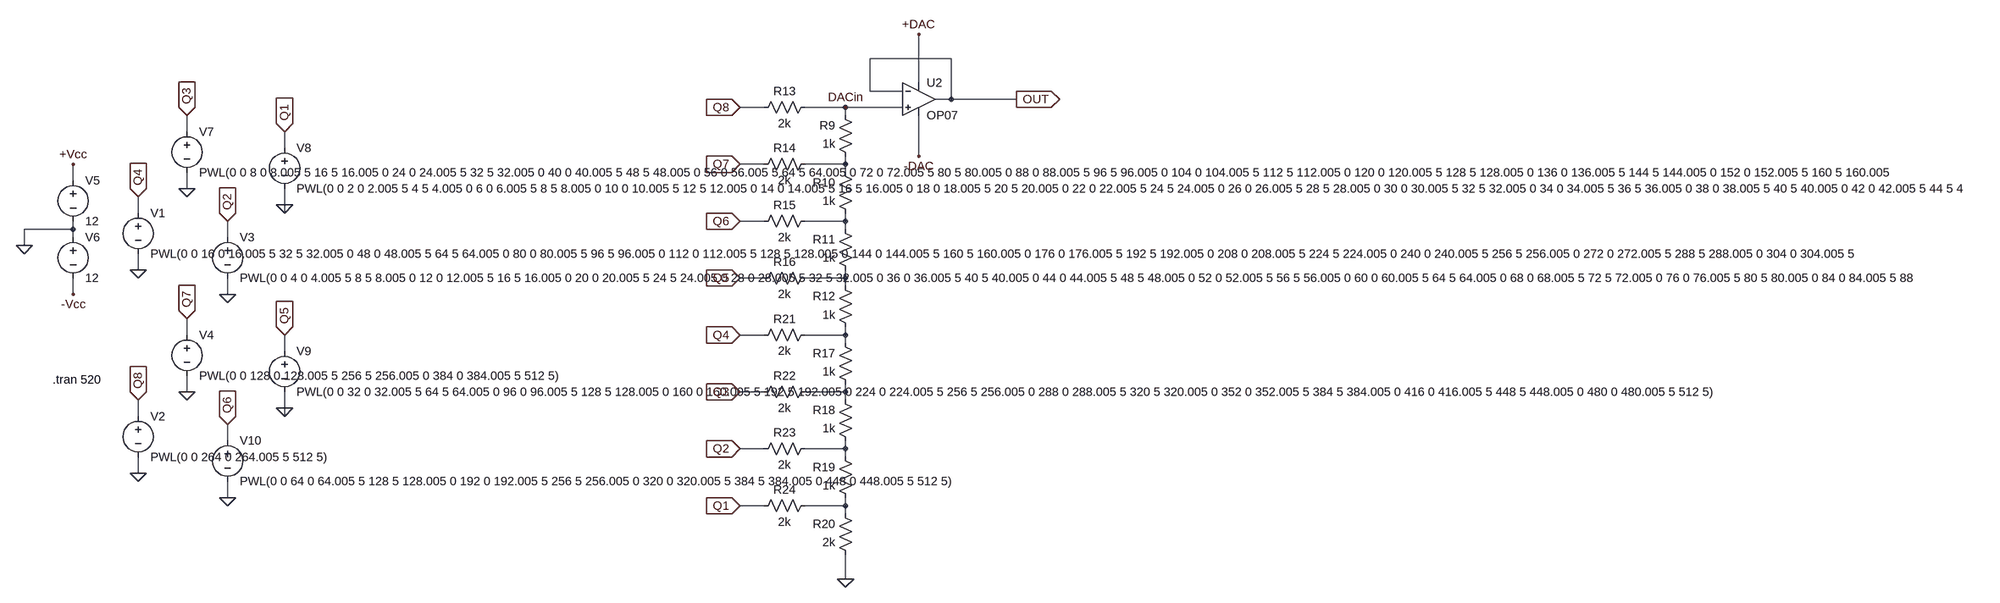
[diagram p0: schematic Ldder_DAC.asc]
Ldder_DAC.asc, the LTspice schematic file:
Version 4
SHEET 1 48964 1184
WIRE 1312 144 1152 144
WIRE 1248 192 1248 96
WIRE 1152 208 1152 144
WIRE 1216 208 1152 208
WIRE 1312 224 1312 144
WIRE 1312 224 1280 224
WIRE 1440 224 1312 224
WIRE 944 240 896 240
WIRE 1104 240 1024 240
WIRE 1216 240 1104 240
WIRE 1104 256 1104 240
WIRE -192 288 -192 256
WIRE 0 320 0 288
WIRE 1248 336 1248 256
WIRE 944 352 896 352
WIRE 1104 352 1104 336
WIRE 1104 352 1024 352
WIRE 1104 368 1104 352
WIRE -416 384 -416 352
WIRE -192 400 -192 368
WIRE 0 432 0 400
WIRE -288 448 -288 416
WIRE 0 448 0 432
WIRE 944 464 896 464
WIRE 1104 464 1104 448
WIRE 1104 464 1024 464
WIRE -416 480 -416 464
WIRE -416 480 -512 480
WIRE 1104 480 1104 464
WIRE -416 496 -416 480
WIRE -112 496 -112 464
WIRE -512 512 -512 480
WIRE -288 560 -288 528
WIRE 944 576 896 576
WIRE 1104 576 1104 560
WIRE 1104 576 1024 576
WIRE 1104 592 1104 576
WIRE -416 608 -416 576
WIRE -112 608 -112 576
WIRE -192 688 -192 656
WIRE 944 688 896 688
WIRE 1104 688 1104 672
WIRE 1104 688 1024 688
WIRE 1104 704 1104 688
WIRE 0 720 0 688
WIRE -192 800 -192 768
WIRE 944 800 896 800
WIRE 1104 800 1104 784
WIRE 1104 800 1024 800
WIRE 1104 816 1104 800
WIRE 0 832 0 800
WIRE -288 848 -288 816
WIRE 0 848 0 832
WIRE -112 896 -112 864
WIRE 944 912 896 912
WIRE 1104 912 1104 896
WIRE 1104 912 1024 912
WIRE 1104 928 1104 912
WIRE -288 960 -288 928
WIRE -112 1008 -112 976
WIRE 944 1024 896 1024
WIRE 1104 1024 1104 1008
WIRE 1104 1024 1024 1024
WIRE 1104 1040 1104 1024
WIRE 1104 1168 1104 1120
FLAG -288 560 0
FLAG -288 416 Q4
IOPIN -288 416 In
FLAG 1440 224 OUT
IOPIN 1440 224 Out
FLAG 896 240 Q8
IOPIN 896 240 In
FLAG 896 352 Q7
IOPIN 896 352 In
FLAG 896 464 Q6
IOPIN 896 464 In
FLAG 896 576 Q5
IOPIN 896 576 In
FLAG 1248 96 +DAC
FLAG 1248 336 -DAC
FLAG 896 688 Q4
IOPIN 896 688 In
FLAG 896 800 Q3
IOPIN 896 800 In
FLAG 896 912 Q2
IOPIN 896 912 In
FLAG 896 1024 Q1
IOPIN 896 1024 In
FLAG 1104 1168 0
FLAG 1104 240 DACin
FLAG -192 400 0
FLAG -192 256 Q3
IOPIN -192 256 In
FLAG 0 432 0
FLAG 0 288 Q1
IOPIN 0 288 In
FLAG -112 608 0
FLAG -112 464 Q2
IOPIN -112 464 In
FLAG -288 960 0
FLAG -288 816 Q8
IOPIN -288 816 In
FLAG -192 800 0
FLAG -192 656 Q7
IOPIN -192 656 In
FLAG 0 832 0
FLAG 0 688 Q5
IOPIN 0 688 In
FLAG -112 1008 0
FLAG -112 864 Q6
IOPIN -112 864 In
FLAG -416 352 +Vcc
FLAG -512 512 0
FLAG -416 608 -Vcc
SYMBOL voltage -288 432 R0
SYMATTR InstName V1
SYMATTR Value PWL(0 0 16 0 16.005 5 32 5 32.005 0 48 0 48.005 5 64 5 64.005 0 80 0 80.005 5 96 5 96.005 0 112 0 112.005 5 128 5 128.005 0 144 0 144.005 5 160 5 160.005 0 176 0 176.005 5 192 5 192.005 0 208 0 208.005 5 224 5 224.005 0 240 0 240.005 5 256 5 256.005 0 272 0 272.005 5 288 5 288.005 0 304 0 304.005 5 320 5 320.005 0 336 0 336.005 5 352 5 352.005 0 368 0 368.005 5 384 5 384.005 0 400 0 400.005 5 416 5 416.005 0 432 0 432.005 5 448 5 448.005 0 464 0 464.005 5 480 5 480.005 0 496 0 496.005 5 512 5)
SYMBOL OpAmps/OP07 1248 160 R0
SYMATTR InstName U2
SYMBOL Res 1120 352 R180
WINDOW 0 36 76 Left 2
WINDOW 3 36 40 Left 2
SYMATTR InstName R9
SYMATTR Value 1k
SYMBOL Res 1120 464 R180
WINDOW 0 36 76 Left 2
WINDOW 3 36 40 Left 2
SYMATTR InstName R10
SYMATTR Value 1k
SYMBOL Res 1120 576 R180
WINDOW 0 36 76 Left 2
WINDOW 3 36 40 Left 2
SYMATTR InstName R11
SYMATTR Value 1k
SYMBOL Res 1120 688 R180
WINDOW 0 36 76 Left 2
WINDOW 3 36 40 Left 2
SYMATTR InstName R12
SYMATTR Value 1k
SYMBOL Res 1040 224 R90
WINDOW 0 0 56 VBottom 2
WINDOW 3 32 56 VTop 2
SYMATTR InstName R13
SYMATTR Value 2k
SYMBOL Res 1040 336 R90
WINDOW 0 0 56 VBottom 2
WINDOW 3 32 56 VTop 2
SYMATTR InstName R14
SYMATTR Value 2k
SYMBOL Res 1040 448 R90
WINDOW 0 0 56 VBottom 2
WINDOW 3 32 56 VTop 2
SYMATTR InstName R15
SYMATTR Value 2k
SYMBOL Res 1040 560 R90
WINDOW 0 0 56 VBottom 2
WINDOW 3 32 56 VTop 2
SYMATTR InstName R16
SYMATTR Value 2k
SYMBOL Res 1120 800 R180
WINDOW 0 36 76 Left 2
WINDOW 3 36 40 Left 2
SYMATTR InstName R17
SYMATTR Value 1k
SYMBOL Res 1120 912 R180
WINDOW 0 36 76 Left 2
WINDOW 3 36 40 Left 2
SYMATTR InstName R18
SYMATTR Value 1k
SYMBOL Res 1120 1024 R180
WINDOW 0 36 76 Left 2
WINDOW 3 36 40 Left 2
SYMATTR InstName R19
SYMATTR Value 1k
SYMBOL Res 1120 1136 R180
WINDOW 0 36 76 Left 2
WINDOW 3 36 40 Left 2
SYMATTR InstName R20
SYMATTR Value 2k
SYMBOL Res 1040 672 R90
WINDOW 0 0 56 VBottom 2
WINDOW 3 32 56 VTop 2
SYMATTR InstName R21
SYMATTR Value 2k
SYMBOL Res 1040 784 R90
WINDOW 0 0 56 VBottom 2
WINDOW 3 32 56 VTop 2
SYMATTR InstName R22
SYMATTR Value 2k
SYMBOL Res 1040 896 R90
WINDOW 0 0 56 VBottom 2
WINDOW 3 32 56 VTop 2
SYMATTR InstName R23
SYMATTR Value 2k
SYMBOL Res 1040 1008 R90
WINDOW 0 0 56 VBottom 2
WINDOW 3 32 56 VTop 2
SYMATTR InstName R24
SYMATTR Value 2k
SYMBOL voltage -192 272 R0
SYMATTR InstName V7
SYMATTR Value PWL(0 0 8 0 8.005 5 16 5 16.005 0 24 0 24.005 5 32 5 32.005 0 40 0 40.005 5 48 5 48.005 0 56 0 56.005 5 64 5 64.005 0 72 0 72.005 5 80 5 80.005 0 88 0 88.005 5 96 5 96.005 0 104 0 104.005 5 112 5 112.005 0 120 0 120.005 5 128 5 128.005 0 136 0 136.005 5 144 5 144.005 0 152 0 152.005 5 160 5 160.005 0 168 0 168.005 5 176 5 176.005 0 184 0 184.005 5 192 5 192.005 0 200 0 200.005 5 208 5 208.005 0 216 0 216.005 5 224 5 224.005 0 232 0 232.005 5 240 5 240.005 0 248 0 248.005 5 256 5 256.005 0 264 0 264.005 5 272 5 272.005 0 280 0 280.005 5 288 5 288.005 0 296 0 296.005 5 304 5 304.005 0 312 0 312.005 5 320 5 320.005 0 328 0 328.005 5 336 5 336.005 0 344 0 344.005 5 352 5 352.005 0 360 0 360.005 5 368 5 368.005 0 376 0 376.005 5 384 5 384.005 0 392 0 392.005 5 400 5 400.005 0 408 0 408.005 5 416 5 416.005 0 424 0 424.005 5 432 5 432.005 0 440 0 440.005 5 448 5 448.005 0 456 0 456.005 5 464 5 464.005 0 472 0 472.005 5 480 5 480.005 0 488 0 488.005 5 496 5 496.005 0 504 0 504.005 5 512 5)
SYMBOL voltage 0 304 R0
SYMATTR InstName V8
SYMATTR Value PWL(0 0 2 0 2.005 5 4 5 4.005 0 6 0 6.005 5 8 5 8.005 0 10 0 10.005 5 12 5 12.005 0 14 0 14.005 5 16 5 16.005 0 18 0 18.005 5 20 5 20.005 0 22 0 22.005 5 24 5 24.005 0 26 0 26.005 5 28 5 28.005 0 30 0 30.005 5 32 5 32.005 0 34 0 34.005 5 36 5 36.005 0 38 0 38.005 5 40 5 40.005 0 42 0 42.005 5 44 5 44.005 0 46 0 46.005 5 48 5 48.005 0 50 0 50.005 5 52 5 52.005 0 54 0 54.005 5 56 5 56.005 0 58 0 58.005 5 60 5 60.005 0 62 0 62.005 5 64 5 64.005 0 66 0 66.005 5 68 5 68.005 0 70 0 70.005 5 72 5 72.005 0 74 0 74.005 5 76 5 76.005 0 78 0 78.005 5 80 5 80.005 0 82 0 82.005 5 84 5 84.005 0 86 0 86.005 5 88 5 88.005 0 90 0 90.005 5 92 5 92.005 0 94 0 94.005 5 96 5 96.005 0 98 0 98.005 5 100 5 100.005 0 102 0 102.005 5 104 5 104.005 0 106 0 106.005 5 108 5 108.005 0 110 0 110.005 5 112 5 112.005 0 114 0 114.005 5 116 5 116.005 0 118 0 118.005 5 120 5 120.005 0 122 0 122.005 5 124 5 124.005 0 126 0 126.005 5 128 5 128.005 0 130 0 130.005 5 132 5 132.005 0 134 0 134.005 5 136 5 136.005 0 138 0 138.005 5 140 5 140.005 0 142 0 142.005 5 144 5 144.005 0 146 0 146.005 5 148 5 148.005 0 150 0 150.005 5 152 5 152.005 0 154 0 154.005 5 156 5 156.005 0 158 0 158.005 5 160 5 160.005 0 162 0 162.005 5 164 5 164.005 0 166 0 166.005 5 168 5 168.005 0 170 0 170.005 5 172 5 172.005 0 174 0 174.005 5 176 5 176.005 0 178 0 178.005 5 180 5 180.005 0 182 0 182.005 5 184 5 184.005 0 186 0 186.005 5 188 5 188.005 0 190 0 190.005 5 192 5 192.005 0 194 0 194.005 5 196 5 196.005 0 198 0 198.005 5 200 5 200.005 0 202 0 202.005 5 204 5 204.005 0 206 0 206.005 5 208 5 208.005 0 210 0 210.005 5 212 5 212.005 0 214 0 214.005 5 216 5 216.005 0 218 0 218.005 5 220 5 220.005 0 222 0 222.005 5 224 5 224.005 0 226 0 226.005 5 228 5 228.005 0 230 0 230.005 5 232 5 232.005 0 234 0 234.005 5 236 5 236.005 0 238 0 238.005 5 240 5 240.005 0 242 0 242.005 5 244 5 244.005 0 246 0 246.005 5 248 5 248.005 0 250 0 250.005 5 252 5 252.005 0 254 0 254.005 5 256 5 256.005 0 258 0 258.005 5 260 5 260.005 0 262 0 262.005 5 264 5 264.005 0 266 0 266.005 5 268 5 268.005 0 270 0 270.005 5 272 5 272.005 0 274 0 274.005 5 276 5 276.005 0 278 0 278.005 5 280 5 280.005 0 282 0 282.005 5 284 5 284.005 0 286 0 286.005 5 288 5 288.005 0 290 0 290.005 5 292 5 292.005 0 294 0 294.005 5 296 5 296.005 0 298 0 298.005 5 300 5 300.005 0 302 0 302.005 5 304 5 304.005 0 306 0 306.005 5 308 5 308.005 0 310 0 310.005 5 312 5 312.005 0 314 0 314.005 5 316 5 316.005 0 318 0 318.005 5 320 5 320.005 0 322 0 322.005 5 324 5 324.005 0 326 0 326.005 5 328 5 328.005 0 330 0 330.005 5 332 5 332.005 0 334 0 334.005 5 336 5 336.005 0 338 0 338.005 5 340 5 340.005 0 342 0 342.005 5 344 5 344.005 0 346 0 346.005 5 348 5 348.005 0 350 0 350.005 5 352 5 352.005 0 354 0 354.005 5 356 5 356.005 0 358 0 358.005 5 360 5 360.005 0 362 0 362.005 5 364 5 364.005 0 366 0 366.005 5 368 5 368.005 0 370 0 370.005 5 372 5 372.005 0 374 0 374.005 5 376 5 376.005 0 378 0 378.005 5 380 5 380.005 0 382 0 382.005 5 384 5 384.005 0 386 0 386.005 5 388 5 388.005 0 390 0 390.005 5 392 5 392.005 0 394 0 394.005 5 396 5 396.005 0 398 0 398.005 5 400 5 400.005 0 402 0 402.005 5 404 5 404.005 0 406 0 406.005 5 408 5 408.005 0 410 0 410.005 5 412 5 412.005 0 414 0 414.005 5 416 5 416.005 0 418 0 418.005 5 420 5 420.005 0 422 0 422.005 5 424 5 424.005 0 426 0 426.005 5 428 5 428.005 0 430 0 430.005 5 432 5 432.005 0 434 0 434.005 5 436 5 436.005 0 438 0 438.005 5 440 5 440.005 0 442 0 442.005 5 444 5 444.005 0 446 0 446.005 5 448 5 448.005 0 450 0 450.005 5 452 5 452.005 0 454 0 454.005 5 456 5 456.005 0 458 0 458.005 5 460 5 460.005 0 462 0 462.005 5 464 5 464.005 0 466 0 466.005 5 468 5 468.005 0 470 0 470.005 5 472 5 472.005 0 474 0 474.005 5 476 5 476.005 0 478 0 478.005 5 480 5 480.005 0 482 0 482.005 5 484 5 484.005 0 486 0 486.005 5 488 5 488.005 0 490 0 490.005 5 492 5 492.005 0 494 0 494.005 5 496 5 496.005 0 498 0 498.005 5 500 5 500.005 0 502 0 502.005 5 504 5 504.005 0 506 0 506.005 5 508 5 508.005 0 510 0 510.005 5 512 5)
SYMBOL voltage -112 480 R0
SYMATTR InstName V3
SYMATTR Value PWL(0 0 4 0 4.005 5 8 5 8.005 0 12 0 12.005 5 16 5 16.005 0 20 0 20.005 5 24 5 24.005 0 28 0 28.005 5 32 5 32.005 0 36 0 36.005 5 40 5 40.005 0 44 0 44.005 5 48 5 48.005 0 52 0 52.005 5 56 5 56.005 0 60 0 60.005 5 64 5 64.005 0 68 0 68.005 5 72 5 72.005 0 76 0 76.005 5 80 5 80.005 0 84 0 84.005 5 88 5 88.005 0 92 0 92.005 5 96 5 96.005 0 100 0 100.005 5 104 5 104.005 0 108 0 108.005 5 112 5 112.005 0 116 0 116.005 5 120 5 120.005 0 124 0 124.005 5 128 5 128.005 0 132 0 132.005 5 136 5 136.005 0 140 0 140.005 5 144 5 144.005 0 148 0 148.005 5 152 5 152.005 0 156 0 156.005 5 160 5 160.005 0 164 0 164.005 5 168 5 168.005 0 172 0 172.005 5 176 5 176.005 0 180 0 180.005 5 184 5 184.005 0 188 0 188.005 5 192 5 192.005 0 196 0 196.005 5 200 5 200.005 0 204 0 204.005 5 208 5 208.005 0 212 0 212.005 5 216 5 216.005 0 220 0 220.005 5 224 5 224.005 0 228 0 228.005 5 232 5 232.005 0 236 0 236.005 5 240 5 240.005 0 244 0 244.005 5 248 5 248.005 0 252 0 252.005 5 256 5 256.005 0 260 0 260.005 5 264 5 264.005 0 268 0 268.005 5 272 5 272.005 0 276 0 276.005 5 280 5 280.005 0 284 0 284.005 5 288 5 288.005 0 292 0 292.005 5 296 5 296.005 0 300 0 300.005 5 304 5 304.005 0 308 0 308.005 5 312 5 312.005 0 316 0 316.005 5 320 5 320.005 0 324 0 324.005 5 328 5 328.005 0 332 0 332.005 5 336 5 336.005 0 340 0 340.005 5 344 5 344.005 0 348 0 348.005 5 352 5 352.005 0 356 0 356.005 5 360 5 360.005 0 364 0 364.005 5 368 5 368.005 0 372 0 372.005 5 376 5 376.005 0 380 0 380.005 5 384 5 384.005 0 388 0 388.005 5 392 5 392.005 0 396 0 396.005 5 400 5 400.005 0 404 0 404.005 5 408 5 408.005 0 412 0 412.005 5 416 5 416.005 0 420 0 420.005 5 424 5 424.005 0 428 0 428.005 5 432 5 432.005 0 436 0 436.005 5 440 5 440.005 0 444 0 444.005 5 448 5 448.005 0 452 0 452.005 5 456 5 456.005 0 460 0 460.005 5 464 5 464.005 0 468 0 468.005 5 472 5 472.005 0 476 0 476.005 5 480 5 480.005 0 484 0 484.005 5 488 5 488.005 0 492 0 492.005 5 496 5 496.005 0 500 0 500.005 5 504 5 504.005 0 508 0 508.005 5 512 5)
SYMBOL voltage -288 832 R0
SYMATTR InstName V2
SYMATTR Value PWL(0 0 264 0 264.005 5 512 5)
SYMBOL voltage -192 672 R0
SYMATTR InstName V4
SYMATTR Value PWL(0 0 128 0 128.005 5 256 5 256.005 0 384 0 384.005 5 512 5)
SYMBOL voltage 0 704 R0
SYMATTR InstName V9
SYMATTR Value PWL(0 0 32 0 32.005 5 64 5 64.005 0 96 0 96.005 5 128 5 128.005 0 160 0 160.005 5 192 5 192.005 0 224 0 224.005 5 256 5 256.005 0 288 0 288.005 5 320 5 320.005 0 352 0 352.005 5 384 5 384.005 0 416 0 416.005 5 448 5 448.005 0 480 0 480.005 5 512 5)
SYMBOL voltage -112 880 R0
SYMATTR InstName V10
SYMATTR Value PWL(0 0 64 0 64.005 5 128 5 128.005 0 192 0 192.005 5 256 5 256.005 0 320 0 320.005 5 384 5 384.005 0 448 0 448.005 5 512 5)
SYMBOL voltage -416 368 R0
SYMATTR InstName V5
SYMATTR Value 12
SYMBOL voltage -416 480 R0
SYMATTR InstName V6
SYMATTR Value 12
TEXT -456 776 Left 2 !.tran 520

The netlist it stands for:
* Ldder_DAC.asc
V1 Q4 0 PWL(0 0 16 0 16.005 5 32 5 32.005 0 48 0 48.005 5 64 5 64.005 0 80 0 80.005 5 96 5 96.005 0 112 0 112.005 5 128 5 128.005 0 144 0 144.005 5 160 5 160.005 0 176 0 176.005 5 192 5 192.005 0 208 0 208.005 5 224 5 224.005 0 240 0 240.005 5 256 5 256.005 0 272 0 272.005 5 288 5 288.005 0 304 0 304.005 5 320 5 320.005 0 336 0 336.005 5 352 5 352.005 0 368 0 368.005 5 384 5 384.005 0 400 0 400.005 5 416 5 416.005 0 432 0 432.005 5 448 5 448.005 0 464 0 464.005 5 480 5 480.005 0 496 0 496.005 5 512 5)
XU2 DACin OUT +DAC -DAC OUT LT1001  ; OP07, pins In+ In- V+ V- OUT
R9 N001 DACin 1k
R10 N002 N001 1k
R11 N003 N002 1k
R12 N004 N003 1k
R13 DACin Q8 2k
R14 N001 Q7 2k
R15 N002 Q6 2k
R16 N003 Q5 2k
R17 N005 N004 1k
R18 N006 N005 1k
R19 N007 N006 1k
R20 0 N007 2k
R21 N004 Q4 2k
R22 N005 Q3 2k
R23 N006 Q2 2k
R24 N007 Q1 2k
V7 Q3 0 PWL(0 0 8 0 8.005 5 16 5 16.005 0 24 0 24.005 5 32 5 32.005 0 40 0 40.005 5 48 5 48.005 0 56 0 56.005 5 64 5 64.005 0 72 0 72.005 5 80 5 80.005 0 88 0 88.005 5 96 5 96.005 0 104 0 104.005 5 112 5 112.005 0 120 0 120.005 5 128 5 128.005 0 136 0 136.005 5 144 5 144.005 0 152 0 152.005 5 160 5 160.005 0 168 0 168.005 5 176 5 176.005 0 184 0 184.005 5 192 5 192.005 0 200 0 200.005 5 208 5 208.005 0 216 0 216.005 5 224 5 224.005 0 232 0 232.005 5 240 5 240.005 0 248 0 248.005 5 256 5 256.005 0 264 0 264.005 5 272 5 272.005 0 280 0 280.005 5 288 5 288.005 0 296 0 296.005 5 304 5 304.005 0 312 0 312.005 5 320 5 320.005 0 328 0 328.005 5 336 5 336.005 0 344 0 344.005 5 352 5 352.005 0 360 0 360.005 5 368 5 368.005 0 376 0 376.005 5 384 5 384.005 0 392 0 392.005 5 400 5 400.005 0 408 0 408.005 5 416 5 416.005 0 424 0 424.005 5 432 5 432.005 0 440 0 440.005 5 448 5 448.005 0 456 0 456.005 5 464 5 464.005 0 472 0 472.005 5 480 5 480.005 0 488 0 488.005 5 496 5 496.005 0 504 0 504.005 5 512 5)
V8 Q1 0 PWL(0 0 2 0 2.005 5 4 5 4.005 0 6 0 6.005 5 8 5 8.005 0 10 0 10.005 5 12 5 12.005 0 14 0 14.005 5 16 5 16.005 0 18 0 18.005 5 20 5 20.005 0 22 0 22.005 5 24 5 24.005 0 26 0 26.005 5 28 5 28.005 0 30 0 30.005 5 32 5 32.005 0 34 0 34.005 5 36 5 36.005 0 38 0 38.005 5 40 5 40.005 0 42 0 42.005 5 44 5 44.005 0 46 0 46.005 5 48 5 48.005 0 50 0 50.005 5 52 5 52.005 0 54 0 54.005 5 56 5 56.005 0 58 0 58.005 5 60 5 60.005 0 62 0 62.005 5 64 5 64.005 0 66 0 66.005 5 68 5 68.005 0 70 0 70.005 5 72 5 72.005 0 74 0 74.005 5 76 5 76.005 0 78 0 78.005 5 80 5 80.005 0 82 0 82.005 5 84 5 84.005 0 86 0 86.005 5 88 5 88.005 0 90 0 90.005 5 92 5 92.005 0 94 0 94.005 5 96 5 96.005 0 98 0 98.005 5 100 5 100.005 0 102 0 102.005 5 104 5 104.005 0 106 0 106.005 5 108 5 108.005 0 110 0 110.005 5 112 5 112.005 0 114 0 114.005 5 116 5 116.005 0 118 0 118.005 5 120 5 120.005 0 122 0 122.005 5 124 5 124.005 0 126 0 126.005 5 128 5 128.005 0 130 0 130.005 5 132 5 132.005 0 134 0 134.005 5 136 5 136.005 0 138 0 138.005 5 140 5 140.005 0 142 0 142.005 5 144 5 144.005 0 146 0 146.005 5 148 5 148.005 0 150 0 150.005 5 152 5 152.005 0 154 0 154.005 5 156 5 156.005 0 158 0 158.005 5 160 5 160.005 0 162 0 162.005 5 164 5 164.005 0 166 0 166.005 5 168 5 168.005 0 170 0 170.005 5 172 5 172.005 0 174 0 174.005 5 176 5 176.005 0 178 0 178.005 5 180 5 180.005 0 182 0 182.005 5 184 5 184.005 0 186 0 186.005 5 188 5 188.005 0 190 0 190.005 5 192 5 192.005 0 194 0 194.005 5 196 5 196.005 0 198 0 198.005 5 200 5 200.005 0 202 0 202.005 5 204 5 204.005 0 206 0 206.005 5 208 5 208.005 0 210 0 210.005 5 212 5 212.005 0 214 0 214.005 5 216 5 216.005 0 218 0 218.005 5 220 5 220.005 0 222 0 222.005 5 224 5 224.005 0 226 0 226.005 5 228 5 228.005 0 230 0 230.005 5 232 5 232.005 0 234 0 234.005 5 236 5 236.005 0 238 0 238.005 5 240 5 240.005 0 242 0 242.005 5 244 5 244.005 0 246 0 246.005 5 248 5 248.005 0 250 0 250.005 5 252 5 252.005 0 254 0 254.005 5 256 5 256.005 0 258 0 258.005 5 260 5 260.005 0 262 0 262.005 5 264 5 264.005 0 266 0 266.005 5 268 5 268.005 0 270 0 270.005 5 272 5 272.005 0 274 0 274.005 5 276 5 276.005 0 278 0 278.005 5 280 5 280.005 0 282 0 282.005 5 284 5 284.005 0 286 0 286.005 5 288 5 288.005 0 290 0 290.005 5 292 5 292.005 0 294 0 294.005 5 296 5 296.005 0 298 0 298.005 5 300 5 300.005 0 302 0 302.005 5 304 5 304.005 0 306 0 306.005 5 308 5 308.005 0 310 0 310.005 5 312 5 312.005 0 314 0 314.005 5 316 5 316.005 0 318 0 318.005 5 320 5 320.005 0 322 0 322.005 5 324 5 324.005 0 326 0 326.005 5 328 5 328.005 0 330 0 330.005 5 332 5 332.005 0 334 0 334.005 5 336 5 336.005 0 338 0 338.005 5 340 5 340.005 0 342 0 342.005 5 344 5 344.005 0 346 0 346.005 5 348 5 348.005 0 350 0 350.005 5 352 5 352.005 0 354 0 354.005 5 356 5 356.005 0 358 0 358.005 5 360 5 360.005 0 362 0 362.005 5 364 5 364.005 0 366 0 366.005 5 368 5 368.005 0 370 0 370.005 5 372 5 372.005 0 374 0 374.005 5 376 5 376.005 0 378 0 378.005 5 380 5 380.005 0 382 0 382.005 5 384 5 384.005 0 386 0 386.005 5 388 5 388.005 0 390 0 390.005 5 392 5 392.005 0 394 0 394.005 5 396 5 396.005 0 398 0 398.005 5 400 5 400.005 0 402 0 402.005 5 404 5 404.005 0 406 0 406.005 5 408 5 408.005 0 410 0 410.005 5 412 5 412.005 0 414 0 414.005 5 416 5 416.005 0 418 0 418.005 5 420 5 420.005 0 422 0 422.005 5 424 5 424.005 0 426 0 426.005 5 428 5 428.005 0 430 0 430.005 5 432 5 432.005 0 434 0 434.005 5 436 5 436.005 0 438 0 438.005 5 440 5 440.005 0 442 0 442.005 5 444 5 444.005 0 446 0 446.005 5 448 5 448.005 0 450 0 450.005 5 452 5 452.005 0 454 0 454.005 5 456 5 456.005 0 458 0 458.005 5 460 5 460.005 0 462 0 462.005 5 464 5 464.005 0 466 0 466.005 5 468 5 468.005 0 470 0 470.005 5 472 5 472.005 0 474 0 474.005 5 476 5 476.005 0 478 0 478.005 5 480 5 480.005 0 482 0 482.005 5 484 5 484.005 0 486 0 486.005 5 488 5 488.005 0 490 0 490.005 5 492 5 492.005 0 494 0 494.005 5 496 5 496.005 0 498 0 498.005 5 500 5 500.005 0 502 0 502.005 5 504 5 504.005 0 506 0 506.005 5 508 5 508.005 0 510 0 510.005 5 512 5)
V3 Q2 0 PWL(0 0 4 0 4.005 5 8 5 8.005 0 12 0 12.005 5 16 5 16.005 0 20 0 20.005 5 24 5 24.005 0 28 0 28.005 5 32 5 32.005 0 36 0 36.005 5 40 5 40.005 0 44 0 44.005 5 48 5 48.005 0 52 0 52.005 5 56 5 56.005 0 60 0 60.005 5 64 5 64.005 0 68 0 68.005 5 72 5 72.005 0 76 0 76.005 5 80 5 80.005 0 84 0 84.005 5 88 5 88.005 0 92 0 92.005 5 96 5 96.005 0 100 0 100.005 5 104 5 104.005 0 108 0 108.005 5 112 5 112.005 0 116 0 116.005 5 120 5 120.005 0 124 0 124.005 5 128 5 128.005 0 132 0 132.005 5 136 5 136.005 0 140 0 140.005 5 144 5 144.005 0 148 0 148.005 5 152 5 152.005 0 156 0 156.005 5 160 5 160.005 0 164 0 164.005 5 168 5 168.005 0 172 0 172.005 5 176 5 176.005 0 180 0 180.005 5 184 5 184.005 0 188 0 188.005 5 192 5 192.005 0 196 0 196.005 5 200 5 200.005 0 204 0 204.005 5 208 5 208.005 0 212 0 212.005 5 216 5 216.005 0 220 0 220.005 5 224 5 224.005 0 228 0 228.005 5 232 5 232.005 0 236 0 236.005 5 240 5 240.005 0 244 0 244.005 5 248 5 248.005 0 252 0 252.005 5 256 5 256.005 0 260 0 260.005 5 264 5 264.005 0 268 0 268.005 5 272 5 272.005 0 276 0 276.005 5 280 5 280.005 0 284 0 284.005 5 288 5 288.005 0 292 0 292.005 5 296 5 296.005 0 300 0 300.005 5 304 5 304.005 0 308 0 308.005 5 312 5 312.005 0 316 0 316.005 5 320 5 320.005 0 324 0 324.005 5 328 5 328.005 0 332 0 332.005 5 336 5 336.005 0 340 0 340.005 5 344 5 344.005 0 348 0 348.005 5 352 5 352.005 0 356 0 356.005 5 360 5 360.005 0 364 0 364.005 5 368 5 368.005 0 372 0 372.005 5 376 5 376.005 0 380 0 380.005 5 384 5 384.005 0 388 0 388.005 5 392 5 392.005 0 396 0 396.005 5 400 5 400.005 0 404 0 404.005 5 408 5 408.005 0 412 0 412.005 5 416 5 416.005 0 420 0 420.005 5 424 5 424.005 0 428 0 428.005 5 432 5 432.005 0 436 0 436.005 5 440 5 440.005 0 444 0 444.005 5 448 5 448.005 0 452 0 452.005 5 456 5 456.005 0 460 0 460.005 5 464 5 464.005 0 468 0 468.005 5 472 5 472.005 0 476 0 476.005 5 480 5 480.005 0 484 0 484.005 5 488 5 488.005 0 492 0 492.005 5 496 5 496.005 0 500 0 500.005 5 504 5 504.005 0 508 0 508.005 5 512 5)
V2 Q8 0 PWL(0 0 264 0 264.005 5 512 5)
V4 Q7 0 PWL(0 0 128 0 128.005 5 256 5 256.005 0 384 0 384.005 5 512 5)
V9 Q5 0 PWL(0 0 32 0 32.005 5 64 5 64.005 0 96 0 96.005 5 128 5 128.005 0 160 0 160.005 5 192 5 192.005 0 224 0 224.005 5 256 5 256.005 0 288 0 288.005 5 320 5 320.005 0 352 0 352.005 5 384 5 384.005 0 416 0 416.005 5 448 5 448.005 0 480 0 480.005 5 512 5)
V10 Q6 0 PWL(0 0 64 0 64.005 5 128 5 128.005 0 192 0 192.005 5 256 5 256.005 0 320 0 320.005 5 384 5 384.005 0 448 0 448.005 5 512 5)
V5 +Vcc 0 12
V6 0 -Vcc 12
.tran 520
.lib LTC.lib
.backanno
.end